# Altium schematic sheet 16.RK3588_VCCIO6.SchDoc
size A4; SheetNumber: 16; SheetTotal: 21
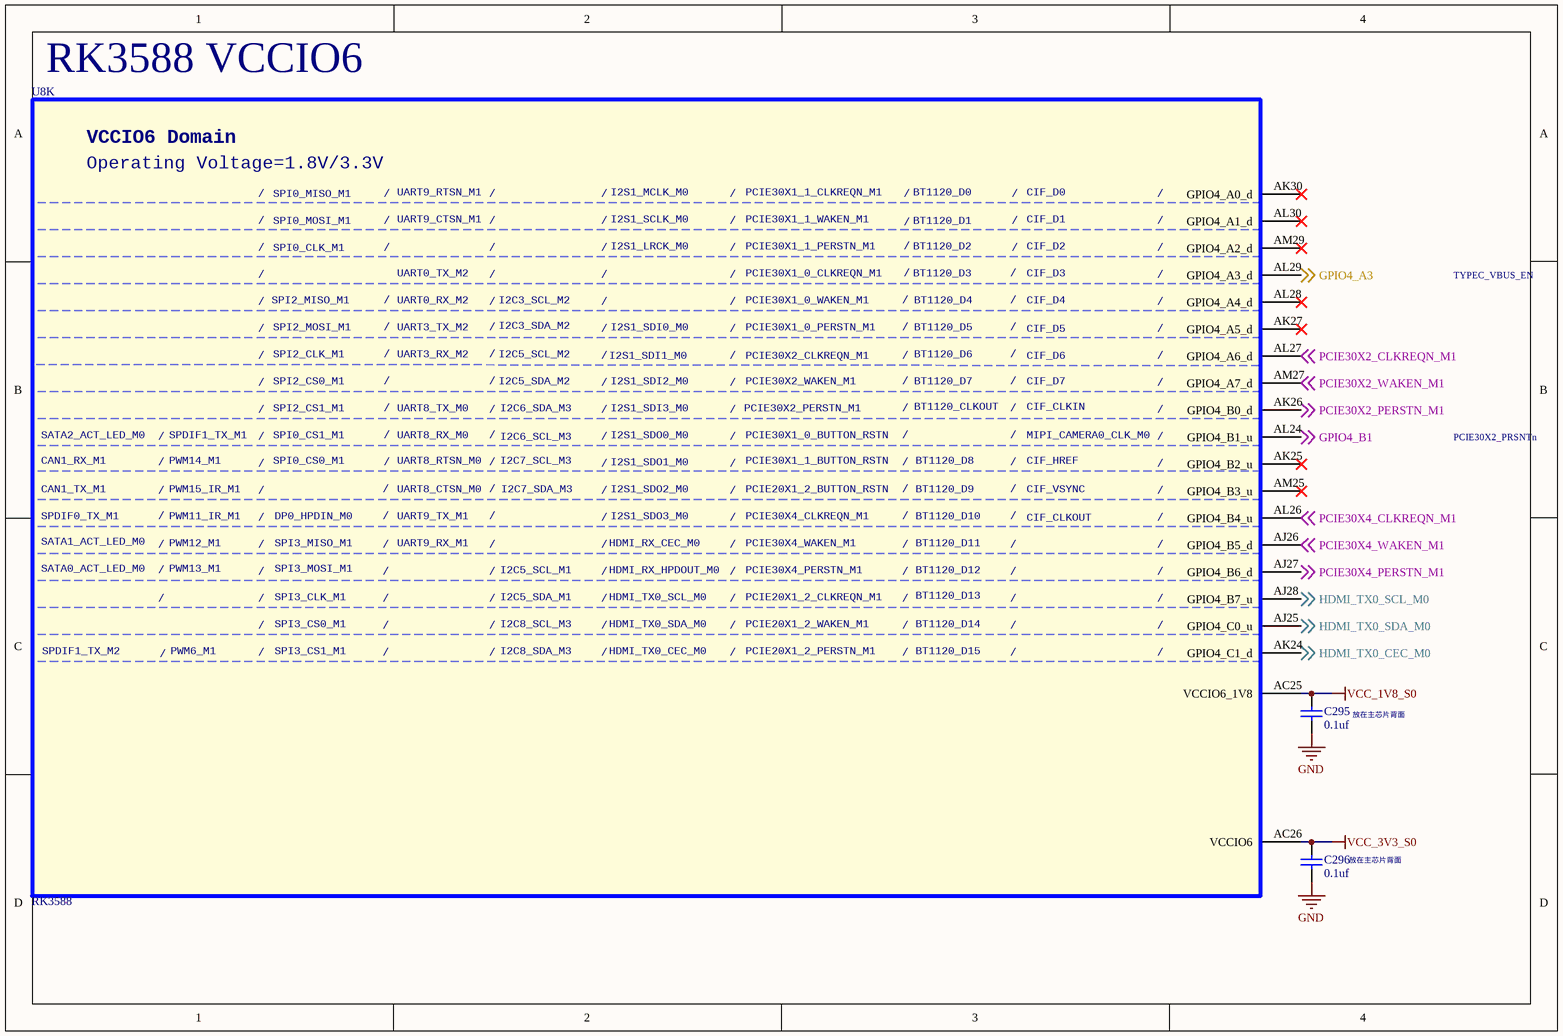
[diagram p0: 16.RK3588_VCCIO6.SchDoc]

## Parts
C295  0.1uf  [C0201_L]
C296  0.1uf  [C0201_L]
U8  RK3588  [BGA1088_23R00X23R00X2R00]  (part K of 26)

## Nets
GND: C295.1 C296.1
VCC_1V8_S0: C295.2 U8.AC25(VCCIO6_1V8)
VCC_3V3_S0: C296.2 U8.AC26(VCCIO6)
GPIO4_A3: U8.AL29(GPIO4_A3_d) ; off-sheet GPIO4_A3
GPIO4_B1: U8.AL24(GPIO4_B1_u) ; off-sheet GPIO4_B1
HDMI_TX0_CEC_M0: U8.AK24(GPIO4_C1_d) ; off-sheet HDMI_TX0_CEC_M0
HDMI_TX0_SCL_M0: U8.AJ28(GPIO4_B7_u) ; off-sheet HDMI_TX0_SCL_M0
HDMI_TX0_SDA_M0: U8.AJ25(GPIO4_C0_u) ; off-sheet HDMI_TX0_SDA_M0
PCIE30X2_CLKREQN_M1: U8.AL27(GPIO4_A6_d) ; off-sheet PCIE30X2_CLKREQN_M1
PCIE30X2_PERSTN_M1: U8.AK26(GPIO4_B0_d) ; off-sheet PCIE30X2_PERSTN_M1
PCIE30X2_WAKEN_M1: U8.AM27(GPIO4_A7_d) ; off-sheet PCIE30X2_WAKEN_M1
PCIE30X4_CLKREQN_M1: U8.AL26(GPIO4_B4_u) ; off-sheet PCIE30X4_CLKREQN_M1
PCIE30X4_PERSTN_M1: U8.AJ27(GPIO4_B6_d) ; off-sheet PCIE30X4_PERSTN_M1
PCIE30X4_WAKEN_M1: U8.AJ26(GPIO4_B5_d) ; off-sheet PCIE30X4_WAKEN_M1

Not connected (* = marked no-connect by the designer): U8 AK25(GPIO4_B2_u)* AK27(GPIO4_A5_d)* AK30(GPIO4_A0_d)* AL28(GPIO4_A4_d)* AL30(GPIO4_A1_d)* AM25(GPIO4_B3_u)* AM29(GPIO4_A2_d)*

## Notes on the sheet
- RK3588 VCCIO6
- TYPEC_VBUS_EN
- PCIE30X2_PRSNTn
- (near C295) 放在主芯片背面
- (near C296) 放在主芯片背面
- (in symbol SOC_RK3588, part K) VCCIO6 Domain; Operating Voltage=1.8V/3.3V; /; SPI0_MISO_M1; UART9_RTSN_M1; I2S1_MCLK_M0; PCIE30X1_1_CLKREQN_M1; BT1120_D0; CIF_D0; SPI0_MOSI_M1; UART9_CTSN_M1; I2S1_SCLK_M0; PCIE30X1_1_WAKEN_M1; BT1120_D1; CIF_D1; SPI0_CLK_M1; I2S1_LRCK_M0; PCIE30X1_1_PERSTN_M1; BT1120_D2; CIF_D2; UART0_TX_M2; PCIE30X1_0_CLKREQN_M1; BT1120_D3; CIF_D3; SPI2_MISO_M1; UART0_RX_M2; I2C3_SCL_M2; PCIE30X1_0_WAKEN_M1; BT1120_D4; CIF_D4; SPI2_MOSI_M1; UART3_TX_M2; I2C3_SDA_M2; I2S1_SDI0_M0; PCIE30X1_0_PERSTN_M1; BT1120_D5; CIF_D5; SPI2_CLK_M1; UART3_RX_M2; I2C5_SCL_M2; I2S1_SDI1_M0; PCIE30X2_CLKREQN_M1; BT1120_D6; CIF_D6; SPI2_CS0_M1; I2C5_SDA_M2; I2S1_SDI2_M0; PCIE30X2_WAKEN_M1; BT1120_D7; CIF_D7; SPI2_CS1_M1; UART8_TX_M0; I2C6_SDA_M3; I2S1_SDI3_M0; PCIE30X2_PERSTN_M1; BT1120_CLKOUT; CIF_CLKIN; SATA2_ACT_LED_M0; SPDIF1_TX_M1; SPI0_CS1_M1; UART8_RX_M0; I2C6_SCL_M3; I2S1_SDO0_M0; PCIE30X1_0_BUTTON_RSTN; MIPI_CAMERA0_CLK_M0; CAN1_RX_M1; PWM14_M1; SPI0_CS0_M1; UART8_RTSN_M0; I2C7_SCL_M3; I2S1_SDO1_M0; PCIE30X1_1_BUTTON_RSTN; BT1120_D8; CIF_HREF; CAN1_TX_M1; PWM15_IR_M1; UART8_CTSN_M0; I2C7_SDA_M3; I2S1_SDO2_M0; PCIE20X1_2_BUTTON_RSTN; BT1120_D9; CIF_VSYNC; SPDIF0_TX_M1; PWM11_IR_M1; DP0_HPDIN_M0; UART9_TX_M1; I2S1_SDO3_M0; PCIE30X4_CLKREQN_M1; BT1120_D10; CIF_CLKOUT; SATA1_ACT_LED_M0; PWM12_M1; SPI3_MISO_M1; UART9_RX_M1; HDMI_RX_CEC_M0; PCIE30X4_WAKEN_M1; BT1120_D11; SATA0_ACT_LED_M0; PWM13_M1; SPI3_MOSI_M1; I2C5_SCL_M1; HDMI_RX_HPDOUT_M0; PCIE30X4_PERSTN_M1; BT1120_D12; SPI3_CLK_M1; I2C5_SDA_M1; HDMI_TX0_SCL_M0; PCIE20X1_2_CLKREQN_M1; BT1120_D13; SPI3_CS0_M1; I2C8_SCL_M3; HDMI_TX0_SDA_M0; PCIE20X1_2_WAKEN_M1; BT1120_D14; SPDIF1_TX_M2; PWM6_M1; SPI3_CS1_M1; I2C8_SDA_M3; HDMI_TX0_CEC_M0; PCIE20X1_2_PERSTN_M1; BT1120_D15

## Library data of the parts
C295 C296 = C: 贴片电容/MLCC电容
U8 = SOC_RK3588: ROCKCHIP SOC